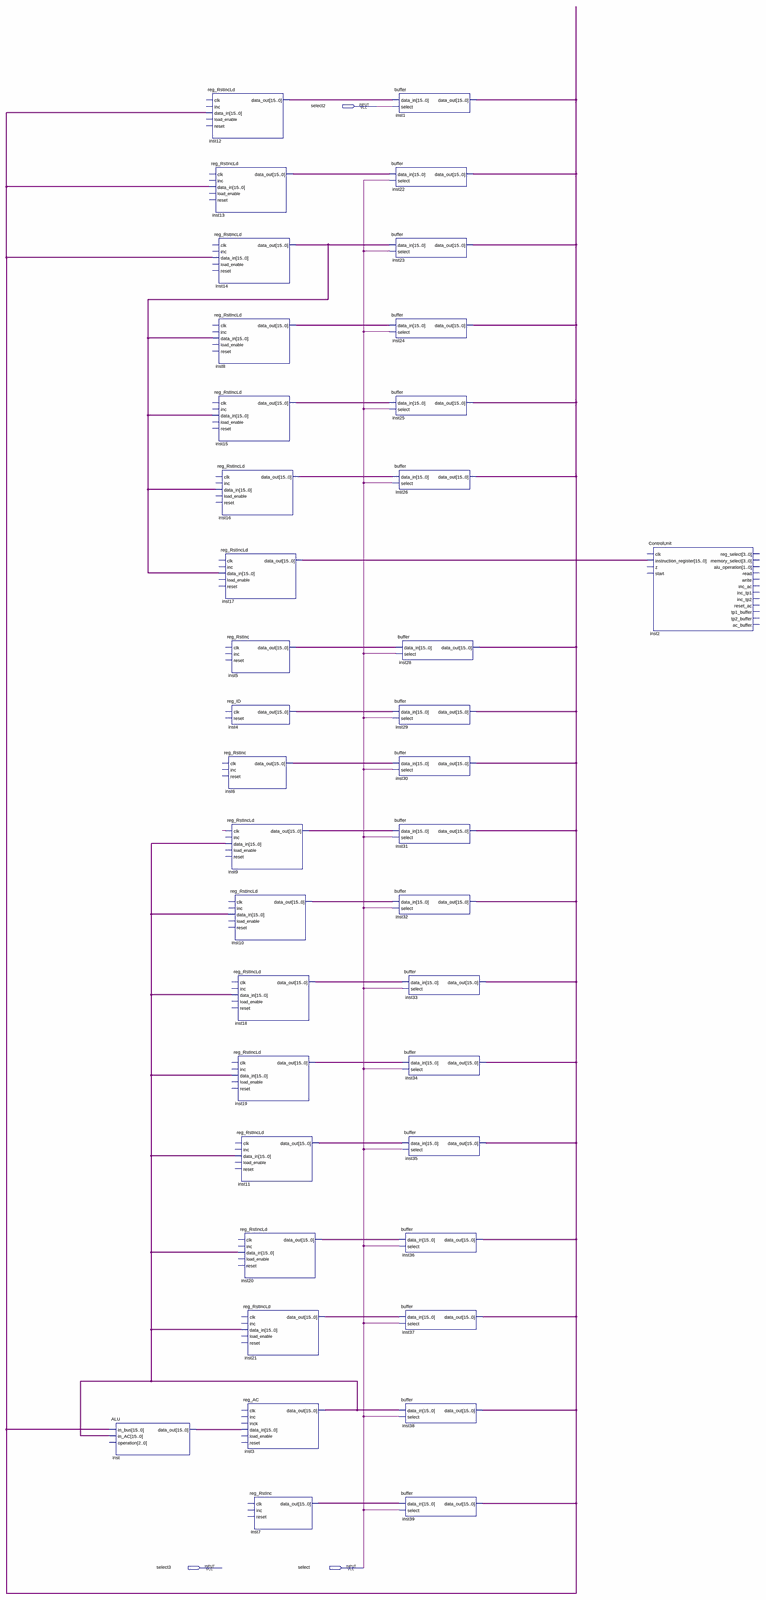
[diagram p0: schematic sheet, whole]
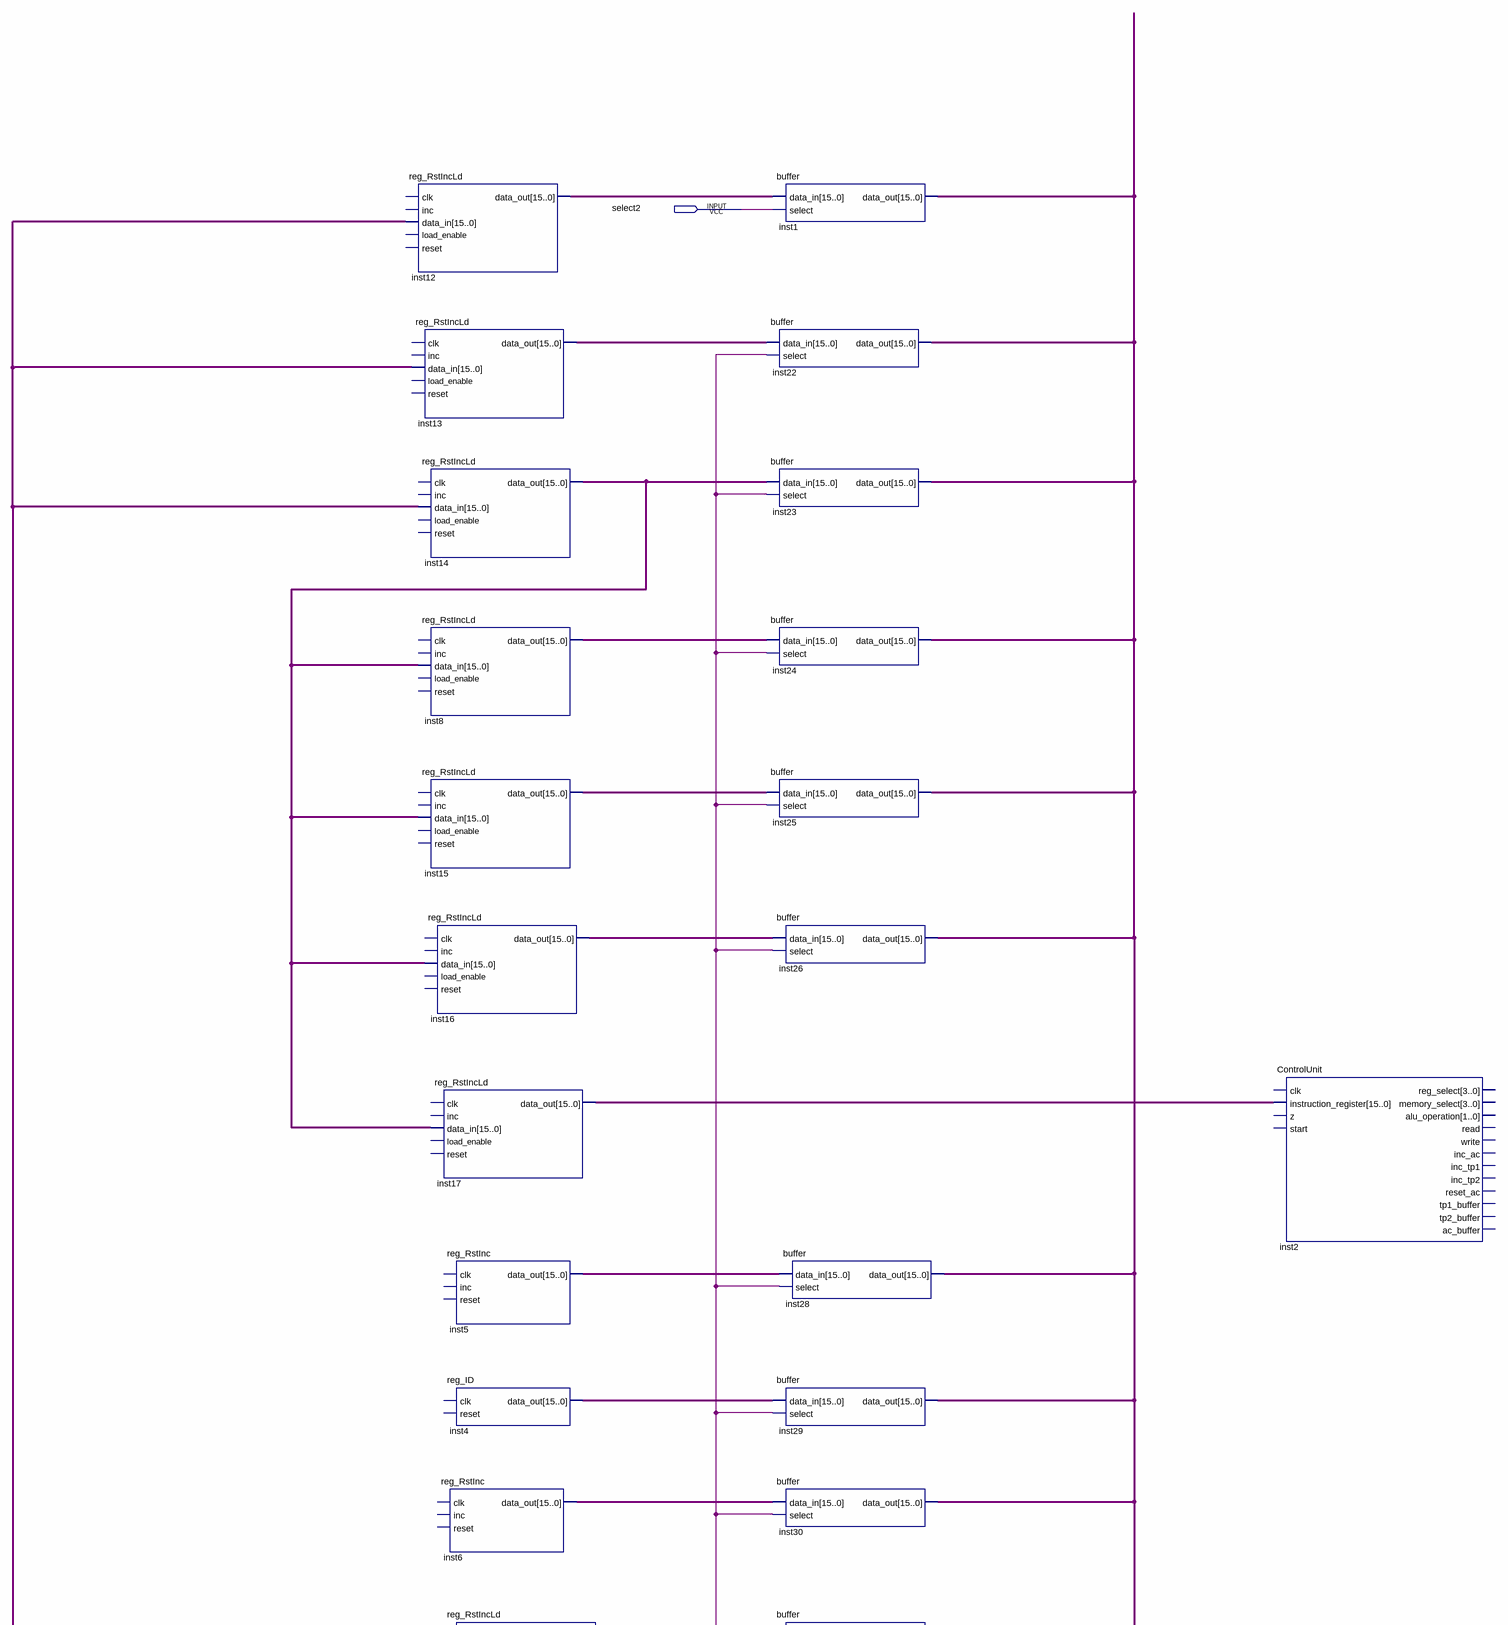
[diagram p1: schematic sheet, upper part]
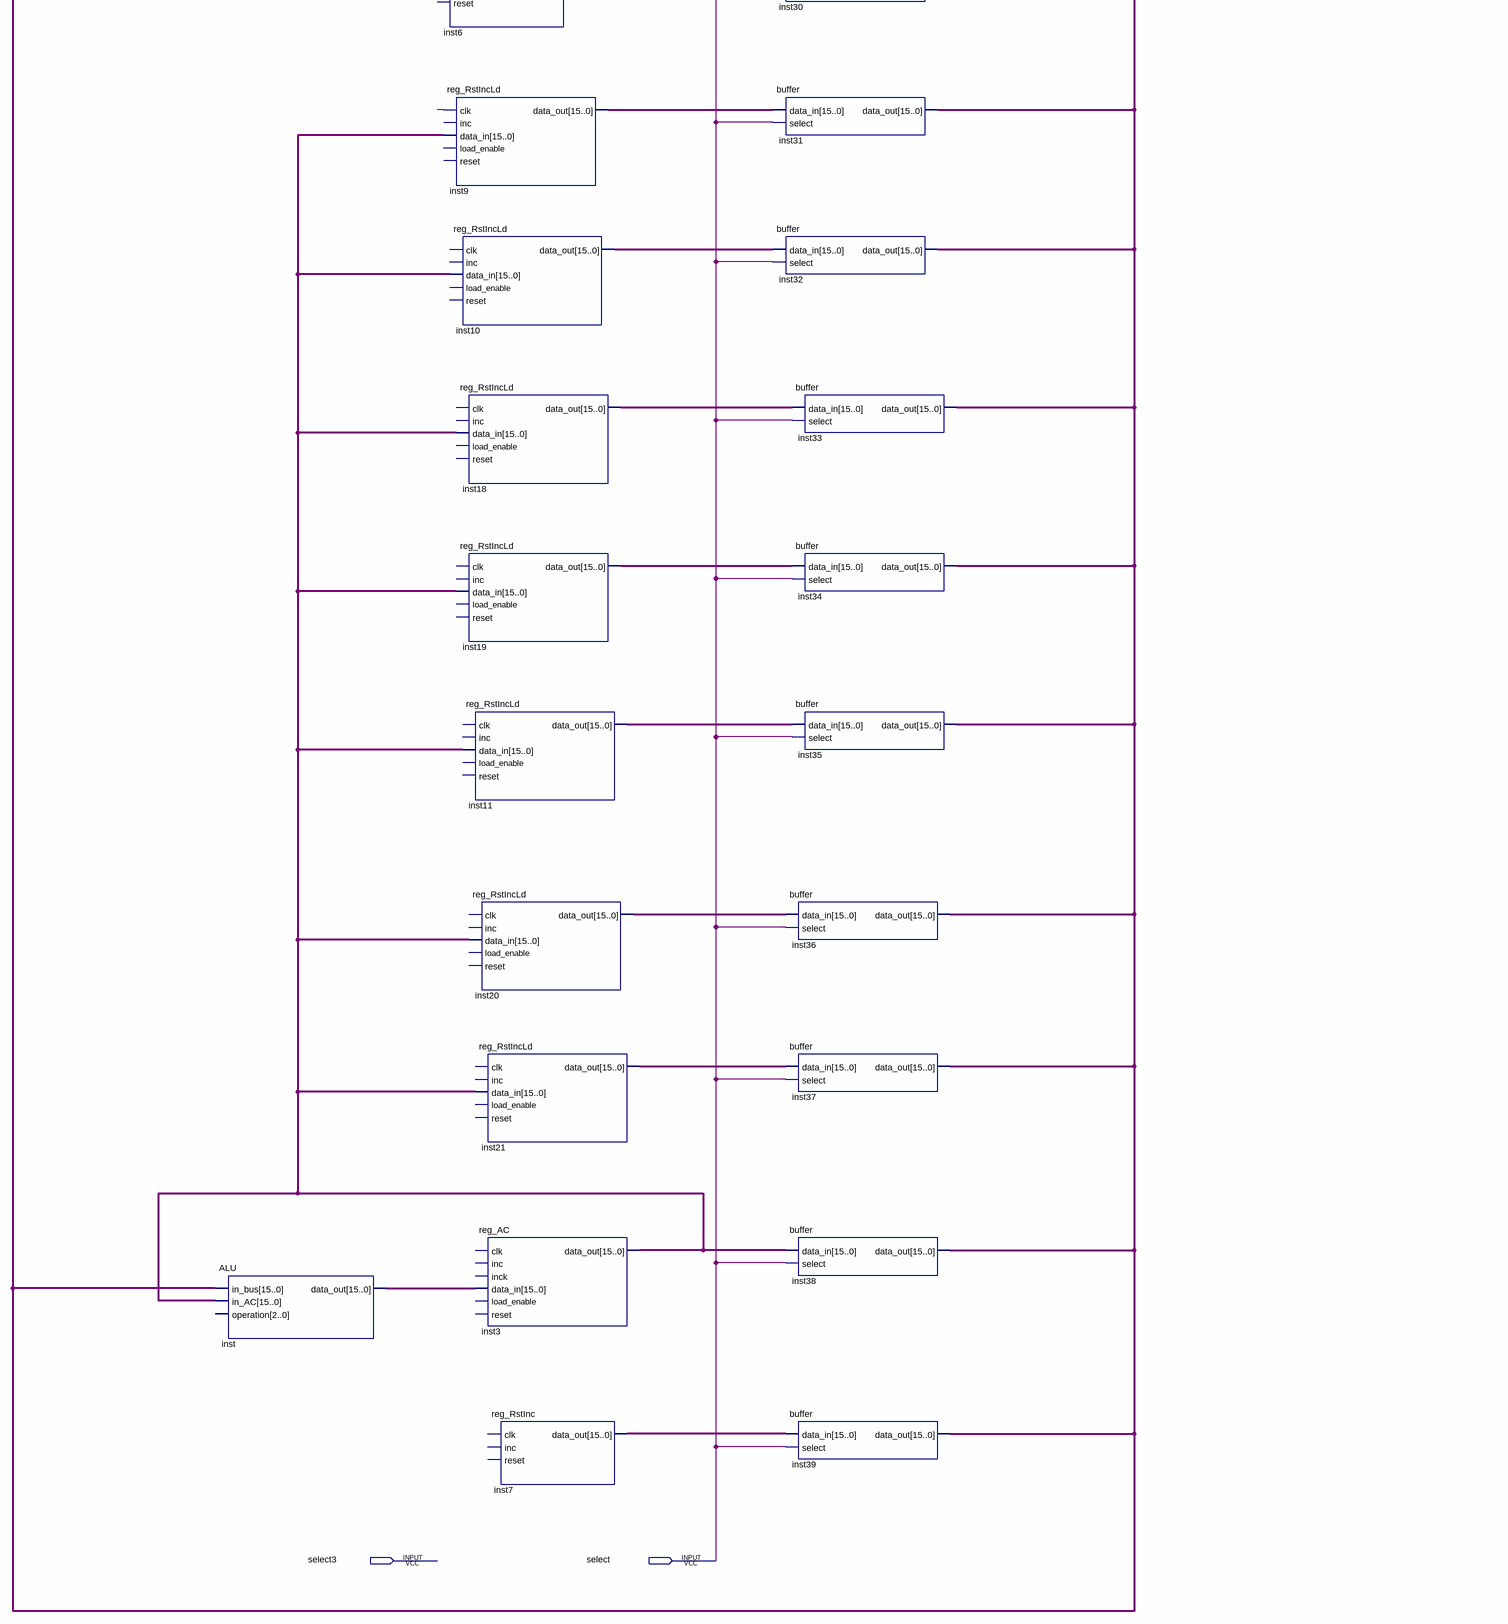
[diagram p2: schematic sheet, lower part]
// Quartus schematic core.bdf as structural Verilog: 39 symbols, 3 pins
module core (
  input  select2,
  input  select3,
  input  select
);

  wire undriven;
  wire [15:0] inst1_data_out, inst3_data_out, inst4_data_out, inst5_data_out, inst6_data_out, inst7_data_out,
       inst8_data_out, inst9_data_out, inst10_data_out, inst11_data_out, inst12_data_out, inst13_data_out,
       inst14_data_out, inst15_data_out, inst16_data_out, inst17_data_out, inst18_data_out, inst19_data_out,
       inst20_data_out, inst21_data_out, inst_data_out;

  ALU inst (.in_bus(inst1_data_out), .in_AC(inst3_data_out), .data_out(inst_data_out));  // open: operation
  reg_RstIncLd inst12 (.data_in(inst1_data_out), .data_out(inst12_data_out));  // open: clk, inc, load_enable, reset
  reg_RstIncLd inst13 (.data_in(inst1_data_out), .data_out(inst13_data_out));  // open: clk, inc, load_enable, reset
  reg_RstIncLd inst14 (.data_in(inst1_data_out), .data_out(inst14_data_out));  // open: clk, inc, load_enable, reset
  reg_RstIncLd inst8 (.data_in(inst14_data_out), .data_out(inst8_data_out));  // open: clk, inc, load_enable, reset
  reg_RstIncLd inst15 (.data_in(inst14_data_out), .data_out(inst15_data_out));  // open: clk, inc, load_enable, reset
  reg_RstIncLd inst16 (.data_in(inst14_data_out), .data_out(inst16_data_out));  // open: clk, inc, load_enable, reset
  reg_RstIncLd inst17 (.data_in(inst14_data_out), .data_out(inst17_data_out));  // open: clk, inc, load_enable, reset
  reg_RstInc inst6 (.data_out(inst6_data_out));  // open: clk, inc, reset
  reg_RstInc inst5 (.data_out(inst5_data_out));  // open: clk, inc, reset
  reg_ID inst4 (.data_out(inst4_data_out));  // open: clk, reset
  reg_RstIncLd inst9 (
    .clk(undriven), .data_in(inst3_data_out), .data_out(inst9_data_out));  // open: inc, load_enable, reset
  reg_RstIncLd inst10 (.data_in(inst3_data_out), .data_out(inst10_data_out));  // open: clk, inc, load_enable, reset
  reg_RstIncLd inst18 (.data_in(inst3_data_out), .data_out(inst18_data_out));  // open: clk, inc, load_enable, reset
  reg_RstIncLd inst19 (.data_in(inst3_data_out), .data_out(inst19_data_out));  // open: clk, inc, load_enable, reset
  reg_RstIncLd inst11 (.data_in(inst3_data_out), .data_out(inst11_data_out));  // open: clk, inc, load_enable, reset
  reg_RstIncLd inst20 (.data_in(inst3_data_out), .data_out(inst20_data_out));  // open: clk, inc, load_enable, reset
  reg_RstIncLd inst21 (.data_in(inst3_data_out), .data_out(inst21_data_out));  // open: clk, inc, load_enable, reset
  reg_AC inst3 (.data_in(inst_data_out), .data_out(inst3_data_out));  // open: clk, inc, inck, load_enable, reset
  reg_RstInc inst7 (.data_out(inst7_data_out));  // open: clk, inc, reset
  buffer inst1 (.data_in(inst12_data_out), .select(select2), .data_out(inst1_data_out));
  buffer inst22 (.data_in(inst13_data_out), .select(select), .data_out(inst1_data_out));
  buffer inst23 (.data_in(inst14_data_out), .select(select), .data_out(inst1_data_out));
  buffer inst24 (.data_in(inst8_data_out), .select(select), .data_out(inst1_data_out));
  buffer inst25 (.data_in(inst15_data_out), .select(select), .data_out(inst1_data_out));
  buffer inst26 (.data_in(inst16_data_out), .select(select), .data_out(inst1_data_out));
  buffer inst28 (.data_in(inst5_data_out), .select(select), .data_out(inst1_data_out));
  buffer inst29 (.data_in(inst4_data_out), .select(select), .data_out(inst1_data_out));
  buffer inst30 (.data_in(inst6_data_out), .select(select), .data_out(inst1_data_out));
  buffer inst31 (.data_in(inst9_data_out), .select(select), .data_out(inst1_data_out));
  buffer inst32 (.data_in(inst10_data_out), .select(select), .data_out(inst1_data_out));
  buffer inst33 (.data_in(inst18_data_out), .select(select), .data_out(inst1_data_out));
  buffer inst34 (.data_in(inst19_data_out), .select(select), .data_out(inst1_data_out));
  buffer inst35 (.data_in(inst11_data_out), .select(select), .data_out(inst1_data_out));
  buffer inst36 (.data_in(inst20_data_out), .select(select), .data_out(inst1_data_out));
  buffer inst37 (.data_in(inst21_data_out), .select(select), .data_out(inst1_data_out));
  buffer inst38 (.data_in(inst3_data_out), .select(select), .data_out(inst1_data_out));
  buffer inst39 (.data_in(inst7_data_out), .select(select), .data_out(inst1_data_out));
  ControlUnit inst2 (.instruction_register(inst17_data_out));  // open: clk, z, start, reg_select, memory_select, alu_operation, read, write, inc_ac, inc_tp1, inc_tp2, reset_ac, tp1_buffer, tp2_buffer, ac_buffer
endmodule
